# EAGLE design flex_adapter (EAGLE 9.5.0)
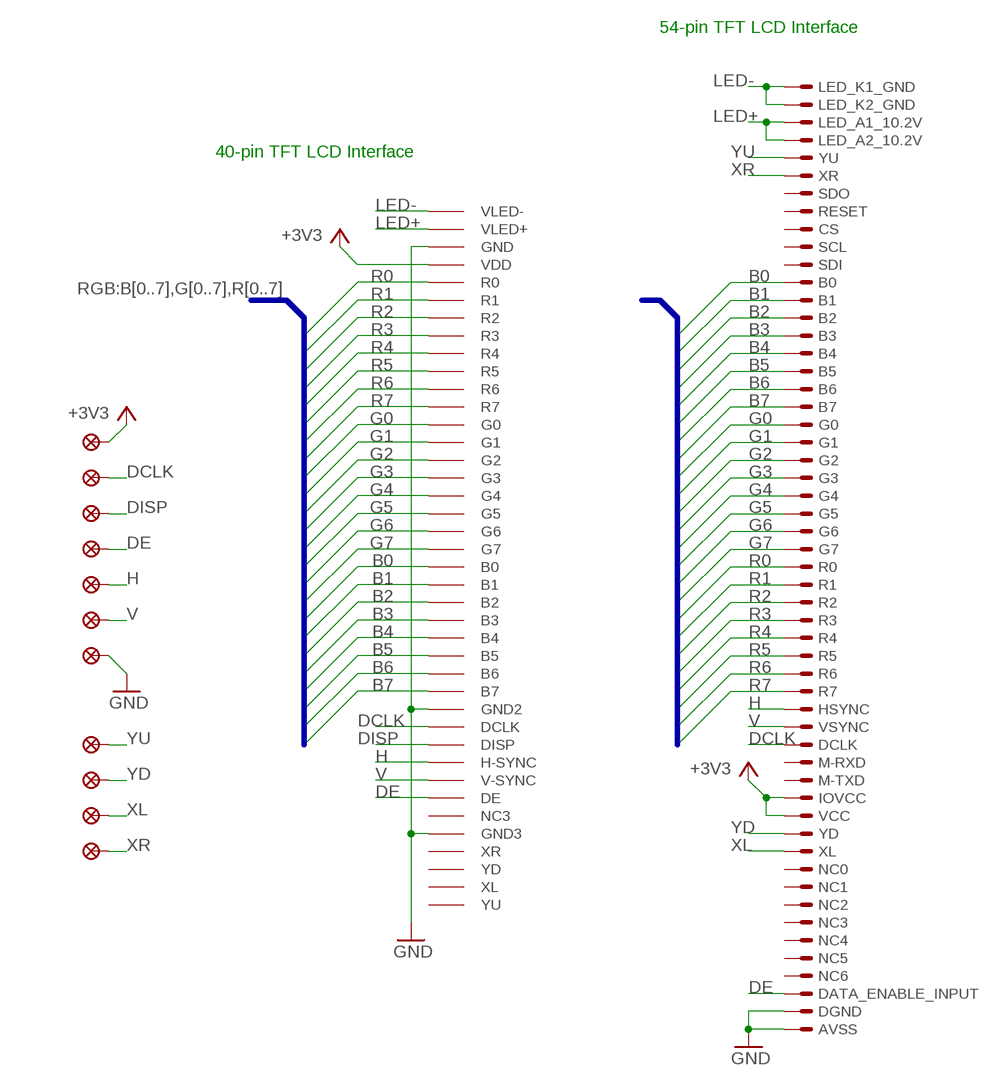
[diagram p0: schematic, sheet 1]

## Parts
U$1  51296-5494  [51296]
U$2  40PIN  [40PIN]
U$3  TESTPAD  [SOLDERPAD]
U$4  TESTPAD  [SOLDERPAD]
U$5  TESTPAD  [SOLDERPAD]
U$6  TESTPAD  [SOLDERPAD]
U$7  TESTPAD  [SOLDERPAD]
U$8  TESTPAD  [SOLDERPAD]
U$9  TESTPAD  [SOLDERPAD]
U$10  TESTPAD  [SOLDERPAD]
U$11  TESTPAD  [SOLDERPAD]
U$12  TESTPAD  [SOLDERPAD]
U$13  TESTPAD  [SOLDERPAD]

## Nets
+3V3: U$1.41(IOVCC) U$1.42(VCC) U$2.P$4(VDD) U$4.P$1
B0: U$1.12(B0) U$2.P$21(B0)
B1: U$1.13(B1) U$2.P$22(B1)
B2: U$1.14(B2) U$2.P$23(B2)
B3: U$1.15(B3) U$2.P$24(B3)
B4: U$1.16(B4) U$2.P$25(B4)
B5: U$1.17(B5) U$2.P$26(B5)
B6: U$1.18(B6) U$2.P$27(B6)
B7: U$1.19(B7) U$2.P$28(B7)
DCLK: U$1.38(DCLK) U$2.P$30(DCLK) U$8.P$1
DE: U$1.52(DATA_ENABLE_INPUT) U$2.P$34(DE) U$6.P$1
DISP: U$2.P$31(DISP) U$7.P$1
G0: U$1.20(G0) U$2.P$13(G0)
G1: U$1.21(G1) U$2.P$14(G1)
G2: U$1.22(G2) U$2.P$15(G2)
G3: U$1.23(G3) U$2.P$16(G3)
G4: U$1.24(G4) U$2.P$17(G4)
G5: U$1.25(G5) U$2.P$18(G5)
G6: U$1.26(G6) U$2.P$19(G6)
G7: U$1.27(G7) U$2.P$20(G7)
GND: U$1.53(DGND) U$1.54(AVSS) U$2.P$3(GND) U$2.P$29(GND2) U$2.P$36(GND3) U$9.P$1
H: U$1.36(HSYNC) U$2.P$32(H-SYNC) U$5.P$1
LED+: U$1.3(LED_A1_10.2V) U$1.4(LED_A2_10.2V) U$2.P$2(VLED+)
LED-: U$1.1(LED_K1_GND) U$1.2(LED_K2_GND) U$2.P$1(VLED-)
R0: U$1.28(R0) U$2.P$5(R0)
R1: U$1.29(R1) U$2.P$6(R1)
R2: U$1.30(R2) U$2.P$7(R2)
R3: U$1.31(R3) U$2.P$8(R3)
R4: U$1.32(R4) U$2.P$9(R4)
R5: U$1.33(R5) U$2.P$10(R5)
R6: U$1.34(R6) U$2.P$11(R6)
R7: U$1.35(R7) U$2.P$12(R7)
V: U$1.37(VSYNC) U$2.P$33(V-SYNC) U$3.P$1
XL: U$1.44(XL) U$12.P$1
XR: U$1.6(XR) U$13.P$1
YD: U$1.43(YD) U$11.P$1
YU: U$1.5(YU) U$10.P$1
Unconnected: U$1.7(SDO) U$1.8(RESET) U$1.9(CS) U$1.10(SCL) U$1.11(SDI) U$1.39(M-RXD) U$1.40(M-TXD) U$1.45(NC0) U$1.46(NC1) U$1.47(NC2) U$1.48(NC3) U$1.49(NC4) U$1.50(NC5) U$1.51(NC6) U$2.P$35(NC3) U$2.P$37(XR) U$2.P$38(YD) U$2.P$39(XL) U$2.P$40(YU)

## Buses
RGB:B[0..7],G[0..7],R[0..7]

## Notes on the sheet
- 54-pin TFT LCD Interface
- 40-pin TFT LCD Interface

## Library data of the parts
U$1 = personal:51296-5494: Molex 0.5mm Pitch, Bottom contacts, 54 positions; AVAILABILITY: Unavailable; DESCRIPTION: Conn.; Rect/PCB; FFC/FPC; 54 Cir.; SMT; ZIF; Rt. Angle; Easy-On Type; Gold Plate; MF: Molex; MP: 51296-5494; PACKAGE: None; PRICE: None
U$2 = personal:40PIN
U$3-U$13 = personal:TESTPAD

## Board
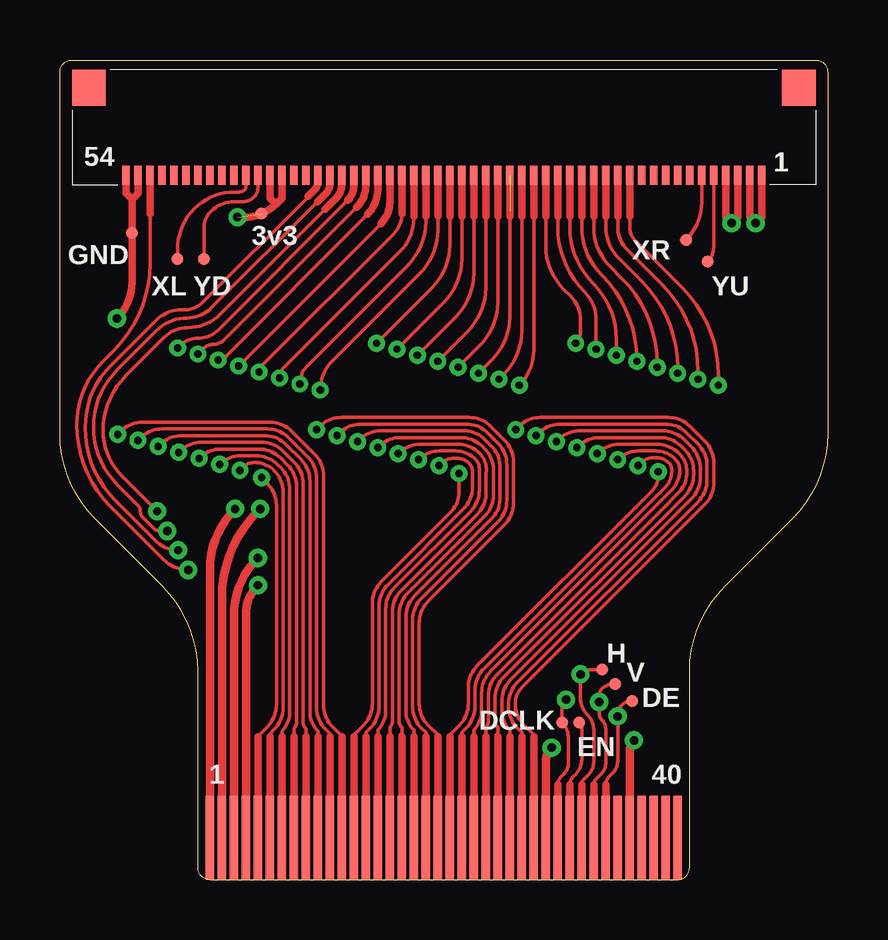
[diagram p1: board, top side]
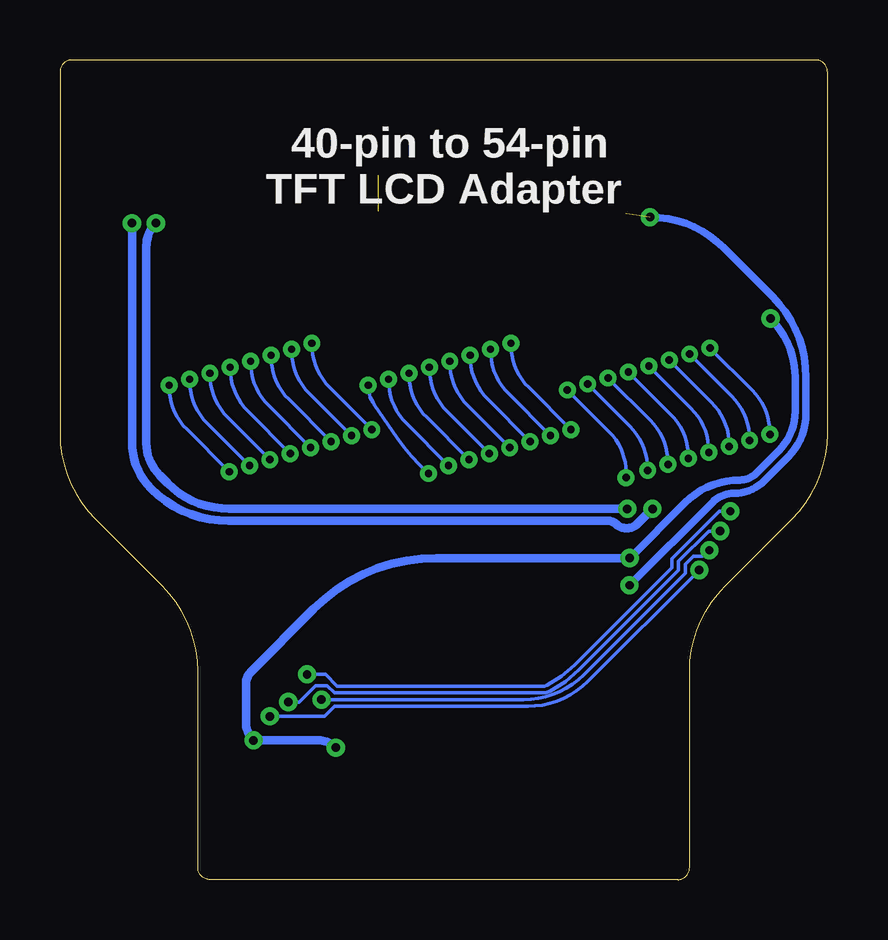
[diagram p2: board, bottom side, seen from below]

Size 32 x 34.15 mm. Coordinates in mm from the lower left corner, seen from the top.
Outline: 6.25,0 25.75,0 arc90 26.25,0.5 26.25,8.68 arc-45 27.71,12.21 30.54,15.04 arc45 32,18.57 32,33.65 arc90 31.5,34.15 0.5,34.15 arc90 0,33.65 0,18.57 arc45 1.46,15.04 4.29,12.21 arc-45 5.75,8.68 5.75,0.5 arc90 6.25,0
Copper layers (1*16): Top 0.035mm / dielectric 1.5mm / Bottom 0.035mm
Design rules "default *": minimum track width 6mil, minimum drill 0.35mm, track to track 5mil, track to pad 5mil, pad to pad 5mil, via to via 5mil, smd to smd 5mil, copper to edge 1mil, drill to drill 6mil, minimum pad ring 10mil, minimum via ring 8mil, stop-mask expansion 0mil, vias tented up to drill 20mil, thermal gap 10mil
tRestrict: 2 lines

### Footprints (pad centres in the part's own frame; a part is rotated, then mirrored left to right if it is on the bottom)
51296 = smd 0.3 x 0.8: 1 -13.25,2.3; 2 -12.75,2.3; 3 -12.25,2.3; 4 -11.75,2.3; 5 -11.25,2.3; 6 -10.75,2.3; 7 -10.25,2.3; 8 -9.75,2.3; 9 -9.25,2.3; 10 -8.75,2.3; 11 -8.25,2.3; 12 -7.75,2.3; 13 -7.25,2.3; 14 -6.75,2.3; 15 -6.25,2.3; 16 -5.75,2.3; 17 -5.25,2.3; 18 -4.75,2.3; 19 -4.25,2.3; 20 -3.75,2.3; 21 -3.25,2.3; 22 -2.75,2.3; 23 -2.25,2.3; 24 -1.75,2.3; 25 -1.25,2.3; 26 -0.75,2.3; 27 -0.25,2.3; 28 0.25,2.3; 29 0.75,2.3; 30 1.25,2.3; 31 1.75,2.3; 32 2.25,2.3; 33 2.75,2.3; 34 3.25,2.3; 35 3.75,2.3; 36 4.25,2.3; 37 4.75,2.3; 38 5.25,2.3; 39 5.75,2.3; 40 6.25,2.3; 41 6.75,2.3; 42 7.25,2.3; 43 7.75,2.3; 44 8.25,2.3; 45 8.75,2.3; 46 9.25,2.3; 47 9.75,2.3; 48 10.25,2.3; 49 10.75,2.3; 50 11.25,2.3; 51 11.75,2.3; 52 12.25,2.3; 53 12.75,2.3; 54 13.25,2.3 | smd 1.4 x 1.5: P$1 -14.8,-1.35; P$2 14.8,-1.35
40PIN = smd 0.35 x 3.5: P$1 -9.25,-2; P$2 -8.75,-2; P$3 -8.25,-2; P$4 -7.75,-2; P$5 -7.25,-2; P$6 -6.75,-2; P$7 -6.25,-2; P$8 -5.75,-2; P$9 -5.25,-2; P$10 -4.75,-2; P$11 -4.25,-2; P$12 -3.75,-2; P$13 -3.25,-2; P$14 -2.75,-2; P$15 -2.25,-2; P$16 -1.75,-2; P$17 -1.25,-2; P$18 -0.75,-2; P$19 -0.25,-2; P$20 0.25,-2; P$21 0.75,-2; P$22 1.25,-2; P$23 1.75,-2; P$24 2.25,-2; P$25 2.75,-2; P$26 3.25,-2; P$27 3.75,-2; P$28 4.25,-2; P$29 4.75,-2; P$30 5.25,-2; P$31 5.75,-2; P$32 6.25,-2; P$33 6.75,-2; P$34 7.25,-2; P$35 7.75,-2; P$36 8.25,-2; P$37 8.75,-2; P$38 9.25,-2; P$39 9.75,-2; P$40 10.25,-2
SOLDERPAD = smd 0.5 x 0.5: P$1 0,0

### Placement (x,y rotation side)
U$1  16,31.65 180 top
U$2  15.5,3.75 0 top
U$3  23.15,8.15 90 top
U$4  8.4,27.75 0 top
U$5  22.6,8.75 90 top
U$6  23.85,7.45 90 top
U$7  21.64,6.55 90 top
U$8  20.93,6.55 90 top
U$9  3,26.95 0 top
U$10  27,25.75 0 top
U$11  6,25.85 0 top
U$12  4.9,25.85 0 top
U$13  26.1,26.65 0 top

### Tracks (layer width: path | path; a pad name or v marks a point on that pad's centre or on a via)
+3V3  (via drill 0.35 pad 0.51)  (1 unrouted)
  Top 0.305: U$1.42 8.75,28.4 9,28.15 | U$1.41 9.25,28.4 9,28.15 | v7.4,27.6 7.67,27.6 arc45 9,28.15
  Top 0.356: U$2.P$4 7.75,11.05 arc-45 v8.25,12.27
  Bottom 0.305: v8.25,12.27 4.79,15.73 arc45 3.9,16.1 arc-45 2.62,16.63 1.64,17.61 arc-45 0.9,19.39 0.9,20.94 arc-45 2.29,24.29 4.33,26.33 arc-45 v7.4,27.6
B0  (via drill 0.3 pad 0.5)
  Top 0.152: 16.25,5.95 16.25,6.03 16.65,6.43 arc45 17.02,7.33 17.02,8.01 arc-45 17.39,8.91 24.69,16.21 arc45 24.94,16.8 v24.94,16.99 | 23.75,27.65 23.75,27.2 arc45 24,26.6 25.96,24.64 arc-45 27.45,21.05 v27.45,20.6
  Top 0.305: U$2.P$21 16.25,5.95 | U$1.12 23.75,27.65
  Bottom 0.152: v24.94,16.99 26.71,18.76 arc45 27.45,20.55 v27.45,20.6
B1  (via drill 0.3 pad 0.5)
  Top 0.152: 16.75,5.95 16.75,6.13 16.93,6.31 arc45 17.3,7.21 17.3,7.9 arc-45 17.67,8.79 25.23,16.35 arc45 25.5,17 25.5,17.11 arc45 25.4,17.35 arc45 24.84,17.58 24.77,17.58 arc45 24.19,17.34 v24.1,17.25 | 23.25,27.65 23.25,27.2 arc45 23.65,26.25 25.11,24.78 arc-45 26.6,21.19 v26.6,20.85
  Top 0.305: U$2.P$22 16.75,5.95 | U$1.13 23.25,27.65
  Bottom 0.152: v24.1,17.25 25.86,19.01 arc45 26.6,20.8 v26.6,20.85
B2  (via drill 0.3 pad 0.5)
  Top 0.152: 17.25,5.95 17.25,6.24 arc45 17.58,7.04 17.58,7.78 arc-45 17.95,8.68 24.81,15.54 24.91,15.64 25.49,16.21 arc45 25.84,17.06 arc45 25.65,17.52 25.64,17.53 arc45 24.84,17.86 24.12,17.86 arc45 v23.25,17.5 | 22.75,27.65 22.75,27.2 arc45 23.29,25.89 24.26,24.92 arc-45 25.75,21.33 v25.75,21.1
  Top 0.305: U$2.P$23 17.25,5.95 | U$1.14 22.75,27.65
  Bottom 0.152: v23.25,17.5 25.01,19.26 arc45 25.75,21.05 v25.75,21.1
B3  (via drill 0.3 pad 0.5)
  Top 0.152: 17.75,5.95 17.75,6.34 arc45 17.86,6.61 17.86,7.67 arc-45 18.23,8.56 24.61,14.94 25.11,15.44 25.77,16.1 arc45 26.14,17 arc45 25.84,17.72 25.79,17.77 arc45 24.9,18.14 23.32,18.14 arc45 22.42,17.77 v22.4,17.75 | 22.25,27.65 22.25,27.2 arc45 22.94,25.54 23.41,25.07 arc-45 24.9,21.47 v24.9,21.35
  Top 0.305: U$2.P$24 17.75,5.95 | U$1.15 22.25,27.65
  Bottom 0.152: v22.4,17.75 24.16,19.51 arc45 24.9,21.3 v24.9,21.35
B4  (via drill 0.3 pad 0.5)
  Top 0.152: 18.17,6.03 18.25,5.95 18.25,6.34 arc-45 18.14,6.61 18.14,7.55 arc-45 18.51,8.45 26.05,15.98 arc45 26.42,16.88 26.42,17.01 arc45 26.05,17.91 25.91,18.05 arc45 25.01,18.42 22.5,18.42 arc45 21.6,18.05 v21.55,18 | 21.75,27.65 21.75,27.2 arc45 22.59,25.19 arc-45 24.05,21.65 v24.05,21.6
  Top 0.305: U$2.P$25 18.25,5.95 | U$1.16 21.75,27.65
  Bottom 0.152: v21.55,18 23.31,19.76 arc45 24.05,21.55 v24.05,21.6
B5  (via drill 0.3 pad 0.5)
  Top 0.152: 18.75,5.95 18.75,6.24 arc-45 18.42,7.04 18.42,7.43 arc-45 18.79,8.33 26.33,15.87 arc45 26.7,16.77 26.7,17.13 arc45 26.33,18.03 26.03,18.33 arc45 25.13,18.7 21.68,18.7 arc45 20.78,18.33 v20.7,18.25 | 21.25,27.65 21.25,27.2 arc45 22.23,24.83 arc-45 23.2,22.5 v23.2,21.85
  Top 0.305: U$2.P$26 18.75,5.95 | U$1.17 21.25,27.65
  Bottom 0.152: v20.7,18.25 22.46,20.01 arc45 23.2,21.8 v23.2,21.85
B6  (via drill 0.3 pad 0.5)
  Top 0.152: 19.25,5.95 19.25,6.13 19.07,6.31 arc-45 18.7,7.21 18.7,7.32 arc-45 19.07,8.22 26.61,15.75 arc45 26.98,16.65 26.98,17.24 arc45 26.61,18.14 26.14,18.61 arc45 25.24,18.98 20.85,18.98 arc45 19.96,18.61 v19.85,18.5 | 20.75,27.65 20.75,27.2 arc45 21.88,24.48 arc-45 22.35,23.34 v22.35,22.1
  Top 0.305: U$2.P$27 19.25,5.95 | U$1.18 20.75,27.65
  Bottom 0.152: v19.85,18.5 21.61,20.26 arc45 22.35,22.05 v22.35,22.1
B7  (via drill 0.3 pad 0.5)
  Top 0.152: 19.75,5.95 19.75,6.03 19.35,6.43 arc-45 18.98,7.32 arc-45 19.27,8.02 26.89,15.64 arc45 27.26,16.53 27.26,17.36 arc45 26.89,18.26 26.26,18.89 arc45 25.36,19.26 20.03,19.26 arc45 19.14,18.89 v19,18.75 | v21.5,22.35 arc45 21.52,22.41 arc45 21.7,22.83 21.7,23.33 arc45 21.3,24.3 20.99,24.61 arc-45 20.25,26.4 20.25,28.1
  Top 0.305: U$2.P$28 19.75,5.95 | 20.25,27.65 20.25,28.1 U$1.19
  Bottom 0.152: v19,18.75 20.76,20.51 arc45 21.5,22.3 v21.5,22.35
DCLK  (via drill 0.35 pad 0.51)
  Top 0.152: v4.93,13.72 arc-45 3.99,14.11 2.32,15.78 arc-45 1.05,18.85 arc-45 2.11,21.41 4,23.3 arc-45 5.09,23.75 5.25,23.75 arc45 5.93,24.03 10.31,28.41 arc45 10.34,28.46 | 20.75,3.95 arc-45 20.89,4.29 21,4.4 arc45 21.2,4.88 21.2,5.9 arc45 U$8.P$1 20.93,7.09 arc-45 v21.1,7.5
  Top 0.305: U$1.38 10.75,29.07 arc-45 10.62,28.75 10.34,28.46 | U$2.P$30 20.75,3.95
  Bottom 0.152: v21.1,7.5 12.67,7.5 arc-45 10.16,8.54 5.93,12.77 5.93,13.14 5.59,13.48 5.22,13.48 5.01,13.69 arc45 v4.93,13.72
DE  (via drill 0.35 pad 0.51)
  Top 0.152: v5.35,12.9 arc-45 4.33,13.32 2.11,15.54 arc-45 0.7,18.95 arc-45 1.8,21.6 2.26,22.06 arc45 3.75,25.65 3.75,27.75 | 22.75,3.95 arc-45 22.89,4.29 23.05,4.45 arc45 23.25,4.93 v23.25,6.8 23.25,6.89 arc-45 23.4,7.25 23.42,7.27 arc-45 U$6.P$1
  Top 0.305: U$2.P$34 22.75,3.95 | U$1.52 3.75,27.75
  Bottom 0.152: v5.35,12.9 9.99,8.26 arc45 12.5,7.22 20.56,7.22 20.98,6.8 v23.25,6.8
DISP
  Top 0.152: 21.25,3.95 arc-45 21.39,4.29 21.5,4.4 arc45 21.75,5 21.75,6.35 21.71,6.62 arc-45 U$7.P$1
  Top 0.305: U$2.P$31 21.25,3.95
G0  (via drill 0.3 pad 0.5)
  Top 0.152: 12.25,5.95 12.25,6.03 12.65,6.43 arc45 13.02,7.33 13.02,11.51 arc-45 13.39,12.41 16.27,15.28 arc45 16.64,16.18 v16.64,16.92 | 19.75,27.65 19.75,22.05 arc-45 v19.15,20.6
  Top 0.305: U$2.P$13 12.25,5.95 | U$1.20 19.75,27.65
  Bottom 0.152: v16.64,16.92 17,17.28 arc10 17.94,18.41 18.89,19.77 arc35 v19.15,20.6
G1  (via drill 0.3 pad 0.5)
  Top 0.152: 12.75,5.95 12.75,6.13 12.93,6.31 arc45 13.3,7.21 13.3,11.4 arc-45 13.67,12.29 16.83,15.45 arc45 17.2,16.35 17.2,16.98 arc45 17.05,17.35 arc45 16.57,17.55 16.4,17.55 arc45 15.89,17.34 v15.8,17.25 | 19.25,27.9 19.25,22.85 arc-45 18.51,21.06 v18.3,20.85
  Top 0.305: U$2.P$14 12.75,5.95 | U$1.21 19.25,27.9 19.25,27.65
  Bottom 0.152: v15.8,17.25 17.56,19.01 arc45 18.3,20.8 v18.3,20.85
G2  (via drill 0.3 pad 0.5)  (1 unrouted)
  Top 0.152: v14.95,17.5 arc-45 15.82,17.86 16.48,17.86 arc-45 17.33,17.51 arc-45 17.48,17.14 17.48,16.23 arc-45 17.11,15.34 13.95,12.18 arc45 13.58,11.28 13.58,7.04 arc-45 13.25,6.24 13.25,5.95 | 18.75,27.65 18.75,23.45 arc-45 18.01,21.66 v17.45,21.1
  Top 0.305: U$2.P$15 13.25,5.95 | U$1.22 18.75,27.65 | 18.75,27.85 18.75,27.64
  Bottom 0.152: v14.95,17.5 16.71,19.26 arc45 17.45,21.05 v17.45,21.1
G3  (via drill 0.3 pad 0.5)
  Top 0.152: v14.1,17.75 14.12,17.77 arc-45 15.02,18.14 16.6,18.14 arc-45 17.48,17.77 arc-54 17.77,16.93 17.77,16.13 arc-45 17.4,15.23 14.23,12.06 arc45 13.86,11.16 13.86,6.61 arc-45 13.75,6.34 13.75,5.95 | 18.25,27.9 18.25,24.05 arc-45 17.51,22.26 v16.6,21.35
  Top 0.305: U$2.P$16 13.75,5.95 | U$1.23 18.25,27.9 18.25,27.65
  Bottom 0.152: v14.1,17.75 15.86,19.51 arc45 16.6,21.3 v16.6,21.35
G4  (via drill 0.3 pad 0.5)
  Top 0.152: v13.25,18 13.3,18.05 arc-45 14.2,18.42 16.71,18.42 arc-45 17.61,18.05 17.7,17.96 arc-45 18.07,17.06 18.07,16.03 arc-45 17.7,15.13 14.51,11.95 arc45 14.14,11.05 14.14,6.61 arc45 14.25,6.34 14.25,5.95 14.17,6.03 | 17.75,27.9 17.75,24.65 arc-45 17.01,22.86 v15.75,21.6
  Top 0.305: U$2.P$17 14.25,5.95 | U$1.24 17.75,27.9 17.75,27.65
  Bottom 0.152: v13.25,18 15.01,19.76 arc45 15.75,21.55 v15.75,21.6
G5  (via drill 0.3 pad 0.5)
  Top 0.152: v12.4,18.25 12.48,18.33 arc-45 13.38,18.7 16.83,18.7 arc-45 17.73,18.33 17.98,18.08 arc-45 18.35,17.18 18.35,15.91 arc-45 17.98,15.02 14.79,11.83 arc45 14.42,10.93 14.42,7.04 arc45 14.75,6.24 14.75,5.95 | 17.25,27.65 17.25,25.25 arc-45 16.51,23.46 v14.9,21.85
  Top 0.305: U$2.P$18 14.75,5.95 | U$1.25 17.25,27.65
  Bottom 0.152: v12.4,18.25 14.16,20.01 arc45 14.9,21.8 v14.9,21.85
G6  (via drill 0.3 pad 0.5)
  Top 0.152: v11.55,18.5 11.66,18.61 arc-45 12.55,18.98 16.94,18.98 arc-45 17.84,18.61 18.26,18.19 arc-45 18.63,17.29 18.63,15.8 arc-45 18.26,14.9 15.07,11.72 arc45 14.7,10.82 14.7,7.21 arc45 15.07,6.31 15.25,6.13 15.25,5.95 | 16.75,27.65 16.75,25.85 arc-45 16.01,24.06 v14.05,22.1
  Top 0.305: U$2.P$19 15.25,5.95 | U$1.26 16.75,27.65
  Bottom 0.152: v11.55,18.5 13.31,20.26 arc45 14.05,22.05 v14.05,22.1
G7  (via drill 0.3 pad 0.5)
  Top 0.152: v10.7,18.75 10.84,18.89 arc-45 11.73,19.26 17.06,19.26 arc-45 17.96,18.89 18.54,18.31 arc-45 18.91,17.41 18.91,15.68 arc-45 18.54,14.79 15.35,11.6 arc45 14.98,10.7 14.98,7.33 arc45 15.35,6.43 15.75,6.03 15.75,5.95 | 13.3,22.35 v13.2,22.35 15.51,24.66 arc45 16.25,26.45 16.25,27.65
  Top 0.305: U$2.P$20 15.75,5.95 | U$1.27 16.25,27.65
  Bottom 0.152: v10.7,18.75 12.46,20.51 arc45 13.2,22.3 v13.2,22.35
GND  (via drill 0.35 pad 0.51)
  Top 0.152: U$9.P$1 3,27.45
  Top 0.305: v2.37,23.38 arc45 3,24.89 3,27.45 3,28.35 | U$1.54 2.75,28.6 3,28.35 | U$1.53 3.25,28.6 3,28.35
  Top 0.356: U$2.P$3 7.25,10.99 arc-45 v8.25,13.4 | U$2.P$36 23.75,5.36 arc-45 v23.93,5.8 | U$2.P$29 20.25,4.9 arc-45 v20.5,5.5
  Bottom 0.305: v8.25,13.4 5.96,15.7 arc45 3.65,16.65 arc-45 2.97,16.93 2.04,17.86 arc-45 1.35,19.52 1.35,20.91 arc-45 v2.37,23.38
  Bottom 0.356: v8.25,13.4 16.3,13.4 arc-45 21.42,11.28 24.04,8.66 arc-45 24.25,8.15 24.25,6.57 arc-45 v23.93,5.8 21.22,5.8 arc45 v20.5,5.5
H  (via drill 0.35 pad 0.51)
  Top 0.152: v4.05,15.35 2.58,16.82 arc-45 1.8,18.7 arc-45 2.76,21 4.35,22.6 arc-45 5.32,23 5.35,23 arc45 6.66,23.54 11.05,27.93 | 21.75,3.95 arc-45 21.86,4.21 22.05,4.4 arc45 22.25,4.88 22.25,6.25 arc45 22,6.85 arc-45 21.7,7.57 v21.7,8.55 arc-45 22.18,8.75 U$5.P$1
  Top 0.305: U$1.36 11.75,28.99 arc-45 11.5,28.38 11.05,27.93 | U$2.P$32 21.75,3.95
  Bottom 0.152: v21.7,8.55 20.93,8.55 20.44,8.06 11.81,8.06 11.7,8.1 11.1,8.47 10.55,8.94 6.49,13 6.49,13.38 4.52,15.35 v4.05,15.35
LED+  (via drill 0.35 pad 0.51)
  Top 0.305: U$1.4 27.75,27.6 v28,27.35 28.25,27.6 U$1.3
  Top 0.356: v8.35,15.45 8.24,15.34 arc45 6.75,11.75 U$2.P$2
  Bottom 0.356: v28,27.35 arc-45 28.4,26.38 28.4,18.19 arc-45 27.84,16.84 27.51,16.51 arc-45 24.95,15.45 v8.35,15.45
LED-  (via drill 0.35 pad 0.51)
  Top 0.305: U$1.2 28.75,27.6 v29,27.35 29.25,27.6 U$1.1
  Top 0.356: v7.3,15.45 arc45 6.25,12.91 U$2.P$1
  Bottom 0.356: v29,27.35 29,18.23 arc-45 28.2,16.29 arc-45 24.97,14.95 9.16,14.95 arc45 8.8,14.8 arc-45 8.44,14.65 8.3,14.65 arc-45 7.96,14.79 v7.3,15.45
R0  (via drill 0.3 pad 0.5)
  Top 0.152: 8.25,5.95 8.25,5.98 8.65,6.38 arc45 9.02,7.28 9.02,14.35 | 9.02,14.35 | 9.02,14.35 9.02,15.6 arc45 8.65,16.5 v8.4,16.75 | 15.75,27.8 15.75,27.05 arc-45 15.01,25.26 11.34,21.59 arc45 v10.85,20.4
  Top 0.305: U$2.P$5 8.25,5.95 | U$1.28 15.75,27.8 15.75,27.65
  Bottom 0.152: v8.4,16.75 8.4,16.97 arc-45 9.09,18.64 v10.85,20.4
R1  (via drill 0.3 pad 0.5)
  Top 0.152: v7.5,17.05 7.63,17.18 arc-45 8.11,17.38 arc-45 8.93,17.04 arc-45 9.3,16.14 9.3,14.47 | 8.75,5.95 8.75,6.08 8.93,6.26 arc45 9.3,7.16 9.3,14.47 | 9.3,14.47 | 15.25,27.65 15.25,27.4 arc-45 14.51,25.61 10.32,21.42 arc45 v10,20.65
  Top 0.305: U$2.P$6 8.75,5.95 | 15.25,27.65 U$1.29
  Bottom 0.152: v7.5,17.05 7.5,17.1 arc-45 8.24,18.89 v10,20.65
R2  (via drill 0.3 pad 0.5)
  Top 0.152: v6.65,17.3 arc-45 7.52,17.66 8.18,17.66 arc-45 9.08,17.29 9.21,17.16 arc-45 9.58,16.26 9.58,6.99 arc-45 9.25,6.19 9.25,5.95 | 14.75,27.65 14.75,27.55 arc-45 14.18,26.18 9.33,21.33 arc45 v9.15,20.9
  Top 0.305: U$2.P$7 9.25,5.95 | U$1.30 14.75,27.65
  Bottom 0.152: v6.65,17.3 6.65,17.35 arc-45 7.39,19.14 v9.15,20.9
R3  (via drill 0.3 pad 0.5)
  Top 0.152: v5.8,17.55 5.82,17.57 arc-45 6.72,17.94 8.3,17.94 arc-45 9.19,17.57 9.49,17.27 arc-45 9.86,16.38 9.86,6.56 arc-45 9.75,6.29 9.75,5.95 | 14.25,27.75 arc-45 13.9,26.9 8.41,21.41 arc45 v8.3,21.15
  Top 0.305: U$2.P$8 9.75,5.95 | U$1.31 14.25,27.75
  Bottom 0.152: v5.8,17.55 5.8,17.6 arc-45 6.54,19.39 v8.3,21.15
R4  (via drill 0.3 pad 0.5)
  Top 0.152: v4.95,17.8 5,17.85 arc-45 5.9,18.22 8.41,18.22 arc-45 9.31,17.85 9.77,17.39 arc-45 10.14,16.49 10.14,6.56 arc45 10.25,6.29 10.25,5.95 | 13.48,27.43 13.38,27.32 v7.45,21.4
  Top 0.305: U$2.P$9 10.25,5.95 | U$1.32 13.75,28.23 arc-45 13.38,27.32
  Bottom 0.152: v4.95,17.8 4.95,17.85 arc-45 5.69,19.64 v7.45,21.4
R5  (via drill 0.3 pad 0.5)
  Top 0.152: v4.1,18.05 4.18,18.13 arc-45 5.07,18.5 8.53,18.5 arc-45 9.43,18.13 10.05,17.51 arc-45 10.42,16.61 10.42,6.99 arc45 10.75,6.19 10.75,5.95 | 12.83,27.73 6.75,21.65 v6.6,21.65
  Top 0.305: U$2.P$10 10.75,5.95 | U$1.33 13.25,28.75 arc-45 12.83,27.73
  Bottom 0.152: v4.1,18.05 4.1,18.1 arc-45 4.84,19.89 v6.6,21.65
R6  (via drill 0.3 pad 0.5)
  Top 0.152: v3.25,18.3 3.36,18.41 arc-45 4.25,18.78 8.64,18.78 arc-45 9.54,18.41 10.33,17.62 arc-45 10.7,16.72 10.7,7.16 arc45 11.07,6.26 11.25,6.08 11.25,5.95 | 5.87,22.02 v5.75,21.9 5.97,22.12 arc-45 6.4,22.3 arc45 6.84,22.48 12.37,28.01
  Top 0.305: U$2.P$11 11.25,5.95 | U$1.34 12.75,28.93 arc-45 12.37,28.01
  Bottom 0.152: v3.25,18.3 3.25,18.35 arc-45 3.99,20.14 v5.75,21.9
R7  (via drill 0.3 pad 0.5)
  Top 0.152: v2.4,18.55 2.54,18.69 arc-45 3.43,19.06 8.76,19.06 arc-45 9.66,18.69 10.61,17.73 arc-45 10.99,16.83 10.99,7.27 arc45 11.36,6.37 11.75,5.98 11.75,5.95 | U$1.35 12.25,29.05 | v4.9,22.15 4.98,22.23 arc-45 5.75,22.55 arc45 6.59,22.9 11.99,28.3
  Top 0.305: U$2.P$12 11.75,5.95 | 12.25,29.28 U$1.35 12.25,28.93 arc-45 11.99,28.3
  Bottom 0.152: v2.4,18.55 2.4,18.6 arc-45 3.14,20.39 v4.9,22.15
V  (via drill 0.35 pad 0.51)
  Top 0.152: 10.73,28.24 6.31,23.82 arc-45 5.3,23.4 arc45 4.02,22.87 2.39,21.24 arc45 1.4,18.85 arc45 2.39,16.46 3.24,15.61 arc-45 3.35,15.35 arc45 3.46,15.09 3.9,14.65 arc45 4.2,14.52 v4.48,14.52 | 22.25,3.95 arc-45 22.36,4.21 22.59,4.44 arc45 22.75,4.83 22.75,6.29 arc45 22.6,6.65 arc-45 22.48,6.94 v22.48,7.4 22.48,7.66 arc-45 22.6,7.95 arc-45 23.08,8.15 U$3.P$1
  Top 0.305: U$1.37 11.25,28.96 arc-45 11.11,28.61 10.73,28.24 | U$2.P$33 22.25,3.95
  Bottom 0.152: v22.48,7.4 22.02,7.4 21.34,8.08 20.86,8.08 20.56,7.78 11.75,7.78 11.57,7.85 10.93,8.25 10.36,8.73 6.21,12.88 6.21,13.26 4.95,14.52 v4.48,14.52
XL
  Top 0.152: U$1.44 7.75,28.87 arc-45 7.7,28.75 arc-45 7.46,28.65 7.29,28.65 arc45 5.6,27.95 arc45 4.9,26.26 U$12.P$1
XR
  Top 0.152: U$1.6 26.75,28.22 arc-45 U$13.P$1
YD
  Top 0.152: 8.25,29.05 U$1.43 8.25,28.81 arc-45 8.1,28.45 arc-45 7.62,28.25 7.27,28.25 arc45 6.3,27.85 arc45 6,27.13 U$11.P$1
YU
  Top 0.152: U$1.5 27.25,26.35 arc-45 U$10.P$1

### Text on the board
tPlace: 3v3 | GND | XR | XL | YD | YU | H | V | DE | DCLK | EN | 1 | 40
bPlace: 40-pin to 54-pin / TFT LCD Adapter